# EAGLE design MYO connector 2 (EAGLE 6.1)
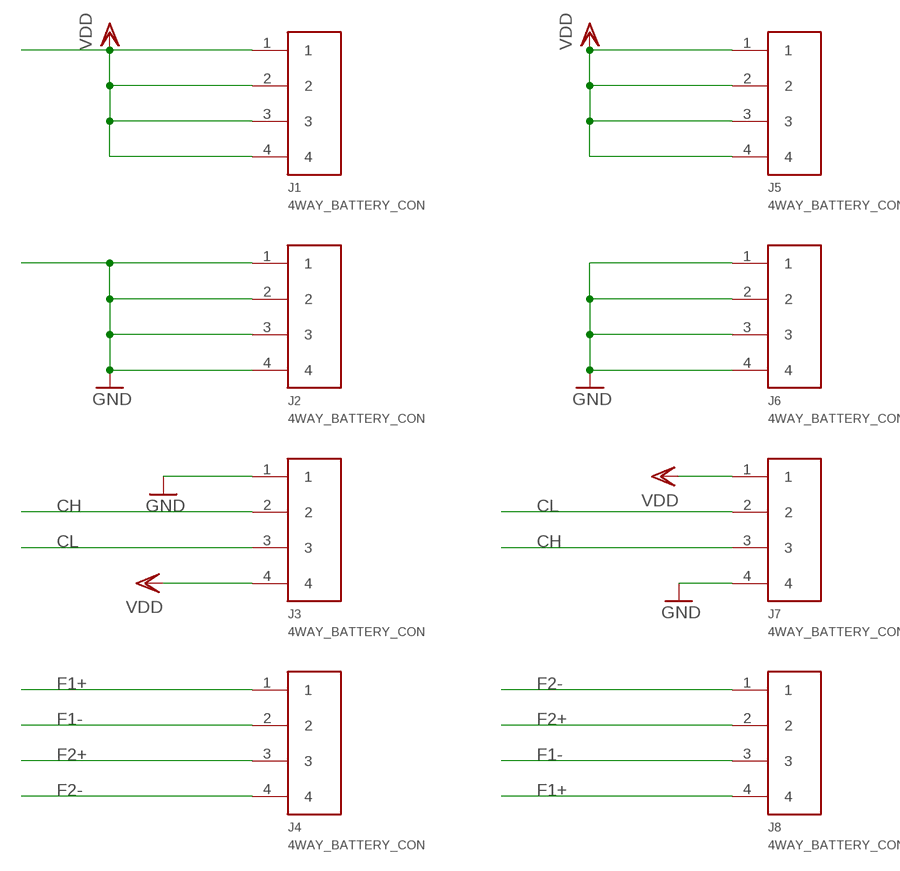
[diagram p0: schematic, sheet 1]

## Parts
J1  4WAY_BATTERY_CON  [4-WAY-BATTERY_CON]
J2  4WAY_BATTERY_CON  [4-WAY-BATTERY_CON]
J3  4WAY_BATTERY_CON  [4-WAY-BATTERY_CON]
J4  4WAY_BATTERY_CON  [4-WAY-BATTERY_CON]
J5  4WAY_BATTERY_CON  [4-WAY-BATTERY_CON]
J6  4WAY_BATTERY_CON  [4-WAY-BATTERY_CON]
J7  4WAY_BATTERY_CON  [4-WAY-BATTERY_CON]
J8  4WAY_BATTERY_CON  [4-WAY-BATTERY_CON]

## Nets
CH: J3.2 J7.3
CL: J3.3 J7.2
F1+: J4.1 J8.4
F1-: J4.2 J8.3
F2+: J4.3 J8.2
F2-: J4.4 J8.1
GND: J2.1 J2.2 J2.3 J2.4 J3.1 J6.1 J6.2 J6.3 J6.4 J7.4
VDD: J1.1 J1.2 J1.3 J1.4 J3.4 J5.1 J5.2 J5.3 J5.4 J7.1

## Library data of the parts
J1-J8 = jas new (2):4WAY_BATTERY_CON

## Board
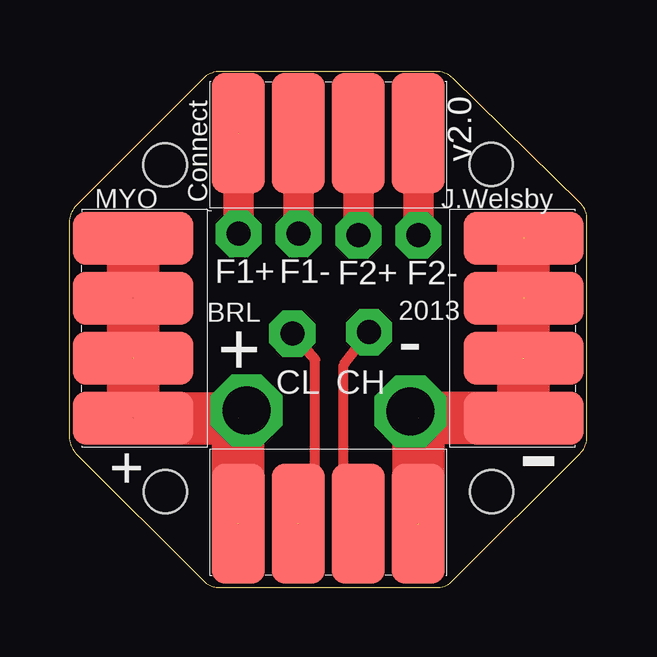
[diagram p1: board, top side]
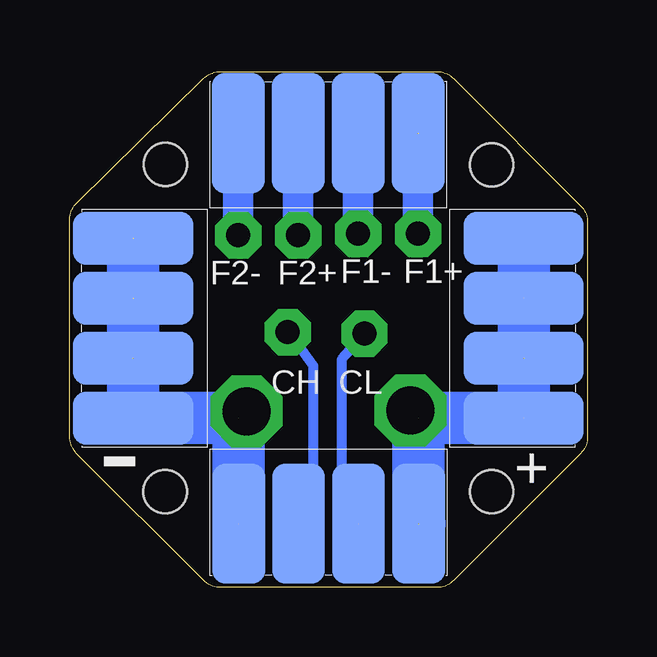
[diagram p2: board, bottom side, seen from below]

Size 21.59 x 21.52 mm. Coordinates in mm from the lower left corner, seen from the top.
Outline: 5.58,21.22 0.29,15.93 arc45 0,15.23 0,6.29 arc45 0.29,5.58 5.58,0.29 arc45 6.29,0 15.3,0 arc45 16.01,0.29 21.3,5.58 arc45 21.59,6.29 21.59,15.34 arc46 21.29,16.06 16.01,21.23 arc44 15.31,21.52 6.29,21.52 arc45 5.58,21.22
Copper layers (1*16): Top 0.035mm / dielectric 1.5mm / Bottom 0.035mm
Design rules: minimum track width 10mil, minimum drill 24mil, track to track 8mil, track to pad 8mil, pad to pad 8mil, via to via 8mil, smd to smd 8mil, copper to edge 40mil, drill to drill 8mil, minimum pad ring 10mil, minimum via ring 8mil, stop-mask expansion 4mil, vias tented up to drill 0mil, thermal gap 10mil
Holes 1.8 mm at 17.6,17.65 4,17.62 4,4 17.61,4.01

### Footprints (pad centres in the part's own frame; a part is rotated, then mirrored left to right if it is on the bottom)
4-WAY-BATTERY_CON = smd 2.2 x 5: 1 -3.75,0; 2 -1.25,0; 3 1.25,0; 4 3.75,0

### Placement (x,y rotation side)
J1  2.67,10.8 90 top
J2  18.95,10.8 270 top
J3  10.8,2.67 180 top
J4  10.8,18.95 0 top
J5  2.66,10.81 270 bottom
J6  18.95,10.81 90 bottom
J7  10.8,2.66 180 bottom
J8  10.81,18.95 0 bottom

### Tracks (layer width: path | path; a pad name or v marks a point on that pad's centre or on a via)
CH  (via drill 1 pad 1.93)
  Top 0.406: J7.3 12.05,4.01 11.44,4.62 11.44,9.28 v12.5,10.65
  Bottom 0.406: v12.5,10.65 12.09,10.15 11.44,9.25 11.44,3.27 J7.3
CL  (via drill 1 pad 1.93)  (1 unrouted)
  Top 0.406: J7.2 9.55,3.99 10.25,4.75 10.25,9.5 v9.3,10.59
  Bottom 0.406: v9.3,10.59 9.37,10.51 10.25,9.5 10.25,4.62 10.25,3.31 9.56,2.62
F1+  (via drill 1 pad 1.93)  (1 unrouted)
  Top 1.27: v7.06,14.75 7.06,18.88
  Bottom 1.27: J8.4 v7.06,14.75
F1-  (via drill 1 pad 1.93)
  Top 1.27: J4.2 9.55,14.58 arc45 v9.56,14.75
  Bottom 1.27: v9.56,14.75 J8.3
F2+  (via drill 1 pad 1.93)
  Top 1.27: v12.06,14.69 12.06,18.93 arc45 J4.3
  Bottom 1.27: J8.2 v12.06,14.69
F2-  (via drill 1 pad 1.93)
  Top 1.27: v14.56,14.69 14.56,18.93 arc45 J4.4
  Bottom 1.27: J8.1 v14.56,14.69
GND  (5 unrouted)
  Top 2.184: J2.2 J2.1 J2.4 J2.3 | J7.4 14.55,7.07 | 14.55,7.07 18.99,7.07 | 14.55,7.07 14.14,7.42
  Bottom 2.184: 14.55,7.07 J6.1 J6.4 | 14.55,7.07 J7.4 | 14.55,7.07 14.14,7.42
N$1  (via drill 2)
  Top 2.184: v7.39,7.39 6.76,6.74
  Bottom 2.184: v7.39,7.39 6.76,6.75
N$2  (via drill 2)
  other vias: 14.23,7.35
VDD  (6 unrouted)
  Top 2.184: J1.4 J5.2 arc37 J1.3 2.67,9.71 | 2.67,9.71 J1.2 | J1.1 7.06,7.05 7.06,7.06 7.05,7.06 J7.1 | 2.67,9.71 2.66,9.71 J5.4
  Bottom 2.184: J5.1 J5.4 7.06,7.06 7.06,2.9 7.04,2.9 7.04,2.65 7.02,2.65

### Text on the board
tNames: v2.0 | MYO | Connect | J.Welsby | F1+ | BRL | F1- | F2+ | F2- | 2013 | + | - | CL | CH | + | -
bNames: F1+ | F1- | F2+ | F2- | CL | CH | + | -